# Altium schematic sheet ATMEGA162.SchDoc
size A4
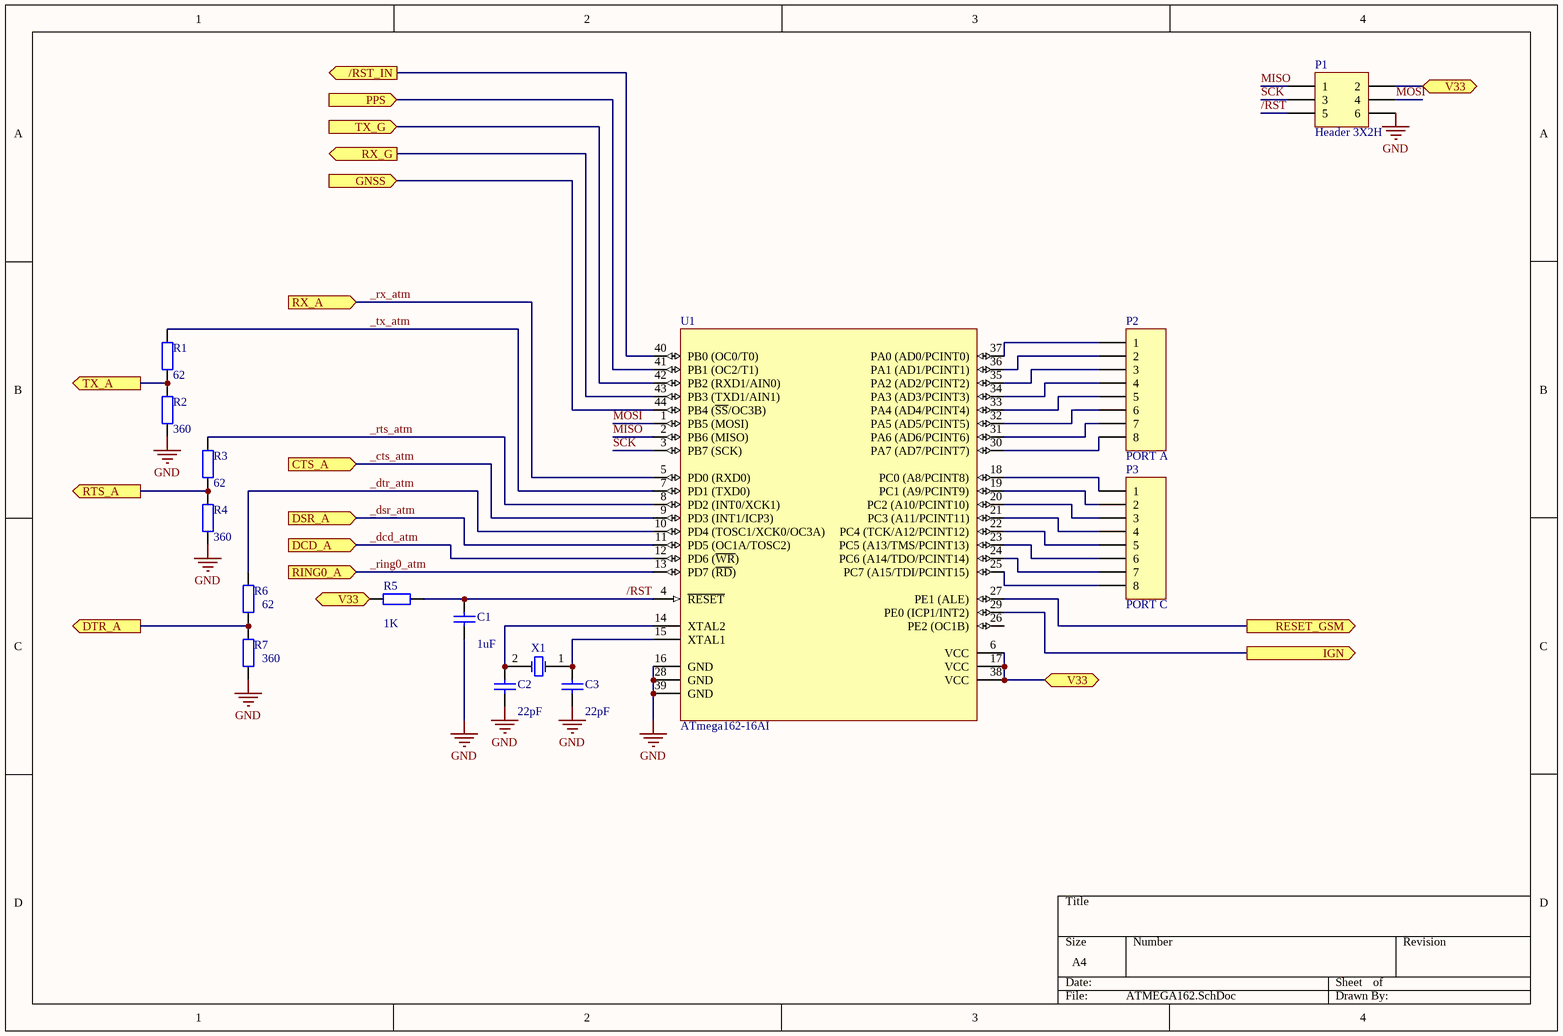
[diagram p0: ATMEGA162.SchDoc]

## Parts
C1  value 1uF  [RAD-0.1]  (hidden comment: Cap)
C2  value 22pF  [RAD-0.1]  (hidden comment: Cap)
C3  value 22pF  [RAD-0.1]  (hidden comment: Cap)
P1  Header 3X2H  [HDR2X3H]
P2  PORT A  [HDR1X8H]
P3  PORT C  [HDR1X8H]
R1  value 62  [AXIAL-0.4]  (hidden comment: Res2)
R2  value 360  [AXIAL-0.4]  (hidden comment: Res2)
R3  value 62  [AXIAL-0.4]  (hidden comment: Res2)
R4  value 360  [AXIAL-0.4]  (hidden comment: Res2)
R5  value 1K  [AXIAL-0.4]  (hidden comment: Res2)
R6  value 62  [AXIAL-0.4]  (hidden comment: Res2)
R7  value 360  [AXIAL-0.4]  (hidden comment: Res2)
U1  ATmega162-16AI  [44A_L]
X1  XTAL  [RAD-0.2]  (value not drawn)

## Ports
/RST_IN (out), CTS_A (in), DCD_A (in), DSR_A (in), DTR_A (out), GNSS (in), IGN (out), PPS (in), RESET_GSM (out), RING0_A (in), RTS_A (out), RX_A (in), RX_G (out), TX_A (out), TX_G (in), V33

## Nets
GND: C1.1 C2.1 C3.1 P1.6 R2.1 R4.1 R7.1 U1.16(GND) U1.28(GND) U1.39(GND)
/RST: C1.2 P1.5 R5.2 U1.4(~{RESET})
/RST_IN: U1.40(PB0_(OC0/T0)) ; port /RST_IN
_cts_atm: U1.9(PD3_(INT1/ICP3)) ; port CTS_A
_dcd_atm: U1.12(PD6_(~{WR})) ; port DCD_A
_dsr_atm: U1.11(PD5_(OC1A/TOSC2)) ; port DSR_A
_dtr_atm: R6.2 U1.10(PD4_(TOSC1/XCK0/OC3A))
_ring0_atm: U1.13(PD7_(~{RD})) ; port RING0_A
_rts_atm: R3.2 U1.8(PD2_(INT0/XCK1))
_rx_atm: U1.5(PD0_(RXD0)) ; port RX_A
_tx_atm: R1.2 U1.7(PD1_(TXD0))
DTR_A: R6.1 R7.2 ; port DTR_A
GNSS: U1.44(PB4_(~{SS}/OC3B)) ; port GNSS
IGN: U1.29(PE0_(ICP1/INT2)) ; port IGN
MISO: P1.1 U1.2(PB6_(MISO))
MOSI: P1.4 U1.1(PB5_(MOSI))
PPS: U1.41(PB1_(OC2/T1)) ; port PPS
RESET_GSM: U1.27(PE1_(ALE)) ; port RESET_GSM
RTS_A: R3.1 R4.2 ; port RTS_A
RX_G: U1.43(PB3_(TXD1/AIN1)) ; port RX_G
SCK: P1.3 U1.3(PB7_(SCK))
TX_A: R1.1 R2.2 ; port TX_A
TX_G: U1.42(PB2_(RXD1/AIN0)) ; port TX_G
V33: P1.2 R5.1 U1.6(VCC) U1.17(VCC) U1.38(VCC) ; port V33
NetC2_2: C2.2 U1.14(XTAL2) X1.2(OSC2)
NetC3_2: C3.2 U1.15(XTAL1) X1.1(OSC1)
NetP2_1: P2.1 U1.37(PA0_(AD0/PCINT0))
NetP2_2: P2.2 U1.36(PA1_(AD1/PCINT1))
NetP2_3: P2.3 U1.35(PA2_(AD2/PCINT2))
NetP2_4: P2.4 U1.34(PA3_(AD3/PCINT3))
NetP2_5: P2.5 U1.33(PA4_(AD4/PCINT4))
NetP2_6: P2.6 U1.32(PA5_(AD5/PCINT5))
NetP2_7: P2.7 U1.31(PA6_(AD6/PCINT6))
NetP2_8: P2.8 U1.30(PA7_(AD7/PCINT7))
NetP3_1: P3.1 U1.18(PC0_(A8/PCINT8))
NetP3_2: P3.2 U1.19(PC1_(A9/PCINT9))
NetP3_3: P3.3 U1.20(PC2_(A10/PCINT10))
NetP3_4: P3.4 U1.21(PC3_(A11/PCINT11))
NetP3_5: P3.5 U1.22(PC4_(TCK/A12/PCINT12))
NetP3_6: P3.6 U1.23(PC5_(A13/TMS/PCINT13))
NetP3_7: P3.7 U1.24(PC6_(A14/TDO/PCINT14))
NetP3_8: P3.8 U1.25(PC7_(A15/TDI/PCINT15))

Not connected (* = marked no-connect by the designer): U1 26(PE2_(OC1B))

## Library data of the parts
C1-C3 = Cap: Capacitor; Published: 8-Jun-2000; LatestRevisionDate: 17-Jul-2002; LatestRevisionNote: Re-released for DXP Platform.; PackageReference: RAD-0.3; Publisher: Altium Limited; PackageDescription: Radial Cap, Thru-Hole; 2 Leads; 0.3 in Pin Spacing
P1 = Header 3X2H: Header, 3-Pin, Dual row, Right Angle; LatestRevisionDate: 17-Jul-2002; LatestRevisionNote: Re-released for DXP Platform.; Publisher: Altium Limited
P2 P3 = Header 8H: Header, 8-Pin, Right Angle; LatestRevisionDate: 17-Jul-2002; LatestRevisionNote: Re-released for DXP Platform.; Publisher: Altium Limited
R1-R7 = Res2: Resistor; Published: 8-Jun-2000; LatestRevisionDate: 17-Jul-2002; LatestRevisionNote: Re-released for DXP Platform.; PackageReference: AXIAL-0.4; Publisher: Altium Limited; PackageDescription: Axial Device, Thru-Hole; 2 Leads; 0.4 in Pin Spacing
U1 = ATmega162-16AI: 8-Bit AVR Microcontroller with 16K Bytes of In-System Programmable Flash Memory; Published: 17-Sep-2003; LatestRevisionDate: 13-Apr-2006; LatestRevisionNote: IPC-7351 Footprint Added.; DatasheetVersion: 2513C-AVR-09/02; PackageVersion: rev.B, Oct-2001; PackageReference: 44A; Publisher: Altium Limited; PackageDescription: 44-Pin Thin Quad Flat Pack 0.8 mm Pitch; ComponentLink1Description: Manufacturer Link; ComponentLink1URL: http://www.atmel.com; ComponentLink2Description: Datasheet; ComponentLink2URL: http://www.atmel.com/dyn/resources/prod_documents/doc2513.pdf; type: atmega162
X1 = XTAL: Crystal Oscillator; Published: 8-Jun-2000; LatestRevisionDate: 17-Jul-2002; LatestRevisionNote: Re-released for DXP Platform.; PackageReference: R38; Publisher: Altium Limited; PackageDescription: Crystal, Thru-Hole; 2 Leads; Body 3.1 x 8.2 mm (Dia.xH)